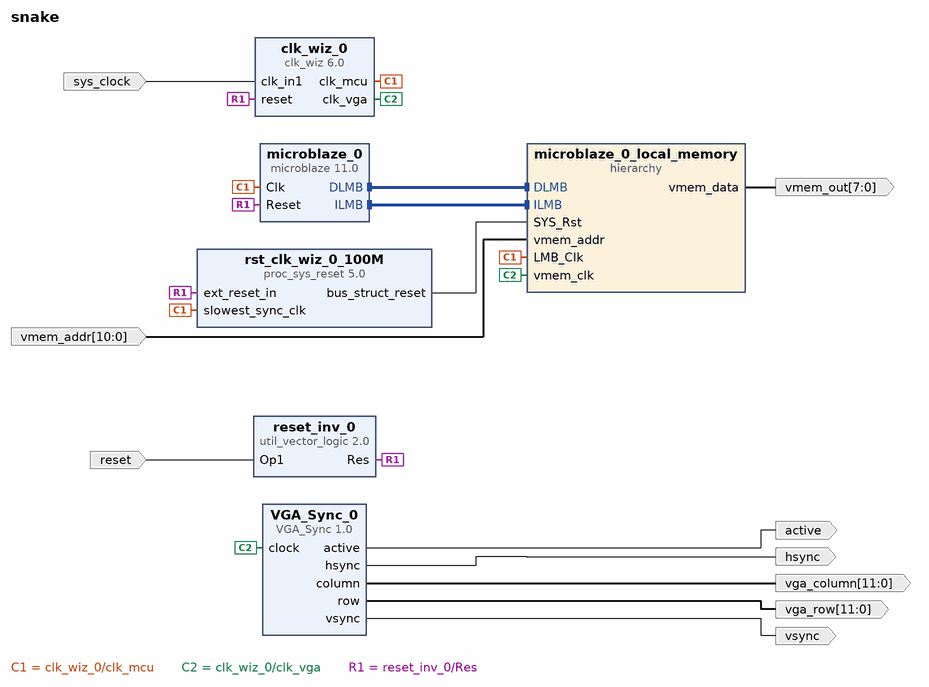
[diagram p0: block diagram of the top level]
# Vivado block design snake, xc7a100tcsg324-1, Vivado 2024.1
create_bd_design snake

create_bd_port -dir I -type clk sys_clock
set_property -dict {CONFIG.FREQ_HZ 100000000 CONFIG.PHASE 0.0} [get_bd_ports sys_clock]
create_bd_port -dir I -type rst reset
set_property -dict {CONFIG.POLARITY ACTIVE_LOW} [get_bd_ports reset]
create_bd_port -dir O vsync
create_bd_port -dir O hsync
create_bd_port -dir O active
create_bd_port -dir O -from 11 -to 0 vga_row
create_bd_port -dir O -from 11 -to 0 vga_column
create_bd_port -dir I -from 10 -to 0 vmem_addr
create_bd_port -dir O -from 7 -to 0 vmem_out

create_bd_cell -type ip -vlnv user.ip:user:VGA_Sync:1.0 VGA_Sync_0
create_bd_cell -type ip -vlnv xilinx.com:ip:clk_wiz:6.0 clk_wiz_0
set_property -dict [list \
  CONFIG.CLKOUT1_DRIVES BUFGCE \
  CONFIG.CLKOUT1_JITTER 139.612 \
  CONFIG.CLKOUT1_PHASE_ERROR 112.291 \
  CONFIG.CLKOUT2_DRIVES BUFGCE \
  CONFIG.CLKOUT2_JITTER 177.272 \
  CONFIG.CLKOUT2_PHASE_ERROR 112.291 \
  CONFIG.CLKOUT2_REQUESTED_OUT_FREQ 31.5 \
  CONFIG.CLKOUT2_USED true \
  CONFIG.CLKOUT3_DRIVES BUFGCE \
  CONFIG.CLKOUT4_DRIVES BUFGCE \
  CONFIG.CLKOUT5_DRIVES BUFGCE \
  CONFIG.CLKOUT6_DRIVES BUFGCE \
  CONFIG.CLKOUT7_DRIVES BUFGCE \
  CONFIG.CLK_IN1_BOARD_INTERFACE sys_clock \
  CONFIG.CLK_OUT1_PORT clk_mcu \
  CONFIG.CLK_OUT2_PORT clk_vga \
  CONFIG.FEEDBACK_SOURCE FDBK_AUTO \
  CONFIG.MMCM_CLKFBOUT_MULT_F 7.875 \
  CONFIG.MMCM_CLKOUT0_DIVIDE_F 7.875 \
  CONFIG.MMCM_CLKOUT1_DIVIDE 25 \
  CONFIG.NUM_OUT_CLKS 2 \
  CONFIG.RESET_BOARD_INTERFACE reset \
  CONFIG.USE_BOARD_FLOW true \
  CONFIG.USE_LOCKED false \
  CONFIG.USE_SAFE_CLOCK_STARTUP true \
] [get_bd_cells clk_wiz_0]
create_bd_cell -type ip -vlnv xilinx.com:ip:util_vector_logic:2.0 reset_inv_0
set_property -dict {CONFIG.C_OPERATION not CONFIG.C_SIZE 1} [get_bd_cells reset_inv_0]
create_bd_cell -type ip -vlnv xilinx.com:ip:microblaze:11.0 microblaze_0
set_property -dict [list \
  CONFIG.C_DEBUG_ENABLED 0 \
  CONFIG.C_D_AXI 0 \
  CONFIG.C_D_LMB 1 \
  CONFIG.C_ENABLE_CONVERSION 0 \
  CONFIG.C_INTERCONNECT 2 \
  CONFIG.C_I_LMB 1 \
  CONFIG.C_USE_BARREL 0 \
  CONFIG.C_USE_DCACHE 0 \
  CONFIG.C_USE_DIV 1 \
  CONFIG.C_USE_ICACHE 0 \
  CONFIG.C_USE_MSR_INSTR 1 \
  CONFIG.C_USE_PCMP_INSTR 1 \
  CONFIG.G_TEMPLATE_LIST 8 \
] [get_bd_cells microblaze_0]
create_bd_cell -type hier microblaze_0_local_memory
create_bd_cell -type ip -vlnv xilinx.com:ip:proc_sys_reset:5.0 rst_clk_wiz_0_100M

# ---- hierarchy /microblaze_0_local_memory ----
current_bd_instance /microblaze_0_local_memory
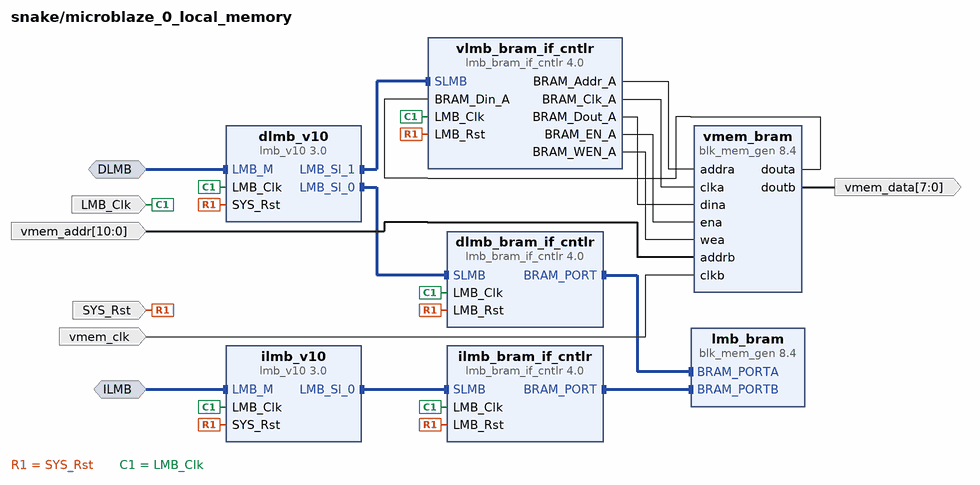
[diagram p1: block diagram inside /microblaze_0_local_memory]
create_bd_intf_pin -mode MirroredMaster -vlnv xilinx.com:interface:lmb_rtl:1.0 DLMB
create_bd_intf_pin -mode MirroredMaster -vlnv xilinx.com:interface:lmb_rtl:1.0 ILMB
create_bd_pin -dir I -type clk LMB_Clk
create_bd_pin -dir I -type rst SYS_Rst
create_bd_pin -dir I -type clk vmem_clk
create_bd_pin -dir I -from 10 -to 0 vmem_addr
create_bd_pin -dir O -from 7 -to 0 vmem_data

create_bd_cell -type ip -vlnv xilinx.com:ip:lmb_v10:3.0 dlmb_v10
set_property -dict {CONFIG.C_LMB_NUM_SLAVES 2} [get_bd_cells dlmb_v10]
create_bd_cell -type ip -vlnv xilinx.com:ip:lmb_v10:3.0 ilmb_v10
create_bd_cell -type ip -vlnv xilinx.com:ip:lmb_bram_if_cntlr:4.0 dlmb_bram_if_cntlr
set_property -dict {CONFIG.C_ECC 0 CONFIG.C_NUM_LMB 1} [get_bd_cells dlmb_bram_if_cntlr]
create_bd_cell -type ip -vlnv xilinx.com:ip:lmb_bram_if_cntlr:4.0 ilmb_bram_if_cntlr
set_property -dict {CONFIG.C_ECC 0} [get_bd_cells ilmb_bram_if_cntlr]
create_bd_cell -type ip -vlnv xilinx.com:ip:blk_mem_gen:8.4 lmb_bram
set_property -dict {CONFIG.Memory_Type True_Dual_Port_RAM CONFIG.use_bram_block BRAM_Controller} [get_bd_cells lmb_bram]
create_bd_cell -type ip -vlnv xilinx.com:ip:blk_mem_gen:8.4 vmem_bram
set_property -dict [list \
  CONFIG.Enable_A Use_ENA_Pin \
  CONFIG.Enable_B Use_ENB_Pin \
  CONFIG.Memory_Type True_Dual_Port_RAM \
  CONFIG.Operating_Mode_A WRITE_FIRST \
  CONFIG.Operating_Mode_B WRITE_FIRST \
  CONFIG.Register_PortA_Output_of_Memory_Core false \
  CONFIG.Register_PortA_Output_of_Memory_Primitives false \
  CONFIG.Register_PortB_Output_of_Memory_Core false \
  CONFIG.Register_PortB_Output_of_Memory_Primitives false \
  CONFIG.Use_Byte_Write_Enable false \
  CONFIG.Use_RSTA_Pin false \
  CONFIG.Write_Depth_A 512 \
  CONFIG.Write_Width_A 32 \
  CONFIG.Write_Width_B 8 \
  CONFIG.use_bram_block Stand_Alone \
] [get_bd_cells vmem_bram]
create_bd_cell -type ip -vlnv xilinx.com:ip:lmb_bram_if_cntlr:4.0 vlmb_bram_if_cntlr

# ---- connections ----

current_bd_instance /microblaze_0_local_memory
connect_bd_intf_net [get_bd_intf_pins vlmb_bram_if_cntlr/SLMB] [get_bd_intf_pins dlmb_v10/LMB_Sl_1]
connect_bd_intf_net -intf_net microblaze_0_dlmb [get_bd_intf_pins dlmb_v10/LMB_M] [get_bd_intf_pins DLMB]
connect_bd_intf_net -intf_net microblaze_0_dlmb_bus [get_bd_intf_pins dlmb_v10/LMB_Sl_0] [get_bd_intf_pins dlmb_bram_if_cntlr/SLMB]
connect_bd_intf_net -intf_net microblaze_0_dlmb_cntlr [get_bd_intf_pins dlmb_bram_if_cntlr/BRAM_PORT] [get_bd_intf_pins lmb_bram/BRAM_PORTA]
connect_bd_intf_net -intf_net microblaze_0_ilmb [get_bd_intf_pins ilmb_v10/LMB_M] [get_bd_intf_pins ILMB]
connect_bd_intf_net -intf_net microblaze_0_ilmb_bus [get_bd_intf_pins ilmb_v10/LMB_Sl_0] [get_bd_intf_pins ilmb_bram_if_cntlr/SLMB]
connect_bd_intf_net -intf_net microblaze_0_ilmb_cntlr [get_bd_intf_pins ilmb_bram_if_cntlr/BRAM_PORT] [get_bd_intf_pins lmb_bram/BRAM_PORTB]
connect_bd_net [get_bd_pins SYS_Rst] \
  [get_bd_pins dlmb_v10/SYS_Rst] [get_bd_pins dlmb_bram_if_cntlr/LMB_Rst] [get_bd_pins ilmb_v10/SYS_Rst] \
  [get_bd_pins ilmb_bram_if_cntlr/LMB_Rst] [get_bd_pins vlmb_bram_if_cntlr/LMB_Rst]
connect_bd_net -net addrb_0_1 [get_bd_pins vmem_addr] [get_bd_pins vmem_bram/addrb]
connect_bd_net -net clk_wiz_0_clk_mcu [get_bd_pins LMB_Clk] \
  [get_bd_pins dlmb_v10/LMB_Clk] [get_bd_pins dlmb_bram_if_cntlr/LMB_Clk] [get_bd_pins ilmb_v10/LMB_Clk] \
  [get_bd_pins ilmb_bram_if_cntlr/LMB_Clk] [get_bd_pins vlmb_bram_if_cntlr/LMB_Clk]
connect_bd_net -net clkb_0_1 [get_bd_pins vmem_clk] [get_bd_pins vmem_bram/clkb]
connect_bd_net [get_bd_pins vlmb_bram_if_cntlr/BRAM_Addr_A] [get_bd_pins vmem_bram/addra]
connect_bd_net [get_bd_pins vlmb_bram_if_cntlr/BRAM_Clk_A] [get_bd_pins vmem_bram/clka]
connect_bd_net [get_bd_pins vlmb_bram_if_cntlr/BRAM_Dout_A] [get_bd_pins vmem_bram/dina]
connect_bd_net [get_bd_pins vlmb_bram_if_cntlr/BRAM_EN_A] [get_bd_pins vmem_bram/ena]
connect_bd_net [get_bd_pins vlmb_bram_if_cntlr/BRAM_WEN_A] [get_bd_pins vmem_bram/wea]
connect_bd_net [get_bd_pins vmem_bram/douta] [get_bd_pins vlmb_bram_if_cntlr/BRAM_Din_A]
connect_bd_net [get_bd_pins vmem_bram/doutb] [get_bd_pins vmem_data]
set_property HDL_ATTRIBUTE.BMM_INFO_ADDRESS_SPACE {byte  0x00000000 32 > snake microblaze_0_local_memory/lmb_bram} [get_bd_cells dlmb_bram_if_cntlr]
set_property HDL_ATTRIBUTE.KEEP_HIERARCHY yes [get_bd_cells dlmb_bram_if_cntlr]
set_property HDL_ATTRIBUTE.BMM_INFO_ADDRESS_RANGE { } [get_bd_cells vlmb_bram_if_cntlr]

current_bd_instance /
connect_bd_intf_net [get_bd_intf_pins microblaze_0/DLMB] [get_bd_intf_pins microblaze_0_local_memory/DLMB]
connect_bd_intf_net [get_bd_intf_pins microblaze_0/ILMB] [get_bd_intf_pins microblaze_0_local_memory/ILMB]
connect_bd_net [get_bd_pins VGA_Sync_0/active] [get_bd_ports active]
connect_bd_net [get_bd_pins VGA_Sync_0/column] [get_bd_ports vga_column]
connect_bd_net [get_bd_pins VGA_Sync_0/hsync] [get_bd_ports hsync]
connect_bd_net [get_bd_pins VGA_Sync_0/row] [get_bd_ports vga_row]
connect_bd_net [get_bd_pins VGA_Sync_0/vsync] [get_bd_ports vsync]
connect_bd_net -net addrb_0_1 [get_bd_ports vmem_addr] [get_bd_pins microblaze_0_local_memory/vmem_addr]
connect_bd_net [get_bd_pins clk_wiz_0/clk_mcu] \
  [get_bd_pins microblaze_0/Clk] [get_bd_pins microblaze_0_local_memory/LMB_Clk] \
  [get_bd_pins rst_clk_wiz_0_100M/slowest_sync_clk]
connect_bd_net [get_bd_pins clk_wiz_0/clk_vga] [get_bd_pins VGA_Sync_0/clock] [get_bd_pins microblaze_0_local_memory/vmem_clk]
connect_bd_net -net microblaze_0_local_memory_doutb_0 [get_bd_pins microblaze_0_local_memory/vmem_data] [get_bd_ports vmem_out]
connect_bd_net [get_bd_ports reset] [get_bd_pins reset_inv_0/Op1]
connect_bd_net [get_bd_pins reset_inv_0/Res] \
  [get_bd_pins clk_wiz_0/reset] [get_bd_pins rst_clk_wiz_0_100M/ext_reset_in] [get_bd_pins microblaze_0/Reset]
connect_bd_net [get_bd_pins rst_clk_wiz_0_100M/bus_struct_reset] [get_bd_pins microblaze_0_local_memory/SYS_Rst]
connect_bd_net [get_bd_ports sys_clock] [get_bd_pins clk_wiz_0/clk_in1]
set_property HDL_ATTRIBUTE.BMM_INFO_PROCESSOR {microblaze-le > snake microblaze_0_local_memory/dlmb_bram_if_cntlr} [get_bd_cells microblaze_0]
set_property HDL_ATTRIBUTE.KEEP_HIERARCHY yes [get_bd_cells microblaze_0]

# ---- address map ----
assign_bd_address -offset 0x00000000 -range 32K -target_address_space [get_bd_addr_spaces microblaze_0/Data] [get_bd_addr_segs microblaze_0_local_memory/dlmb_bram_if_cntlr/SLMB/Mem]
assign_bd_address -offset 0x00080000 -range 8K -target_address_space [get_bd_addr_spaces microblaze_0/Data] [get_bd_addr_segs microblaze_0_local_memory/vlmb_bram_if_cntlr/SLMB/Mem]
assign_bd_address -offset 0x00000000 -range 32K -target_address_space [get_bd_addr_spaces microblaze_0/Instruction] [get_bd_addr_segs microblaze_0_local_memory/ilmb_bram_if_cntlr/SLMB/Mem]

validate_bd_design
save_bd_design
